# EAGLE design Parachute_V1 (EAGLE 9.6.2)
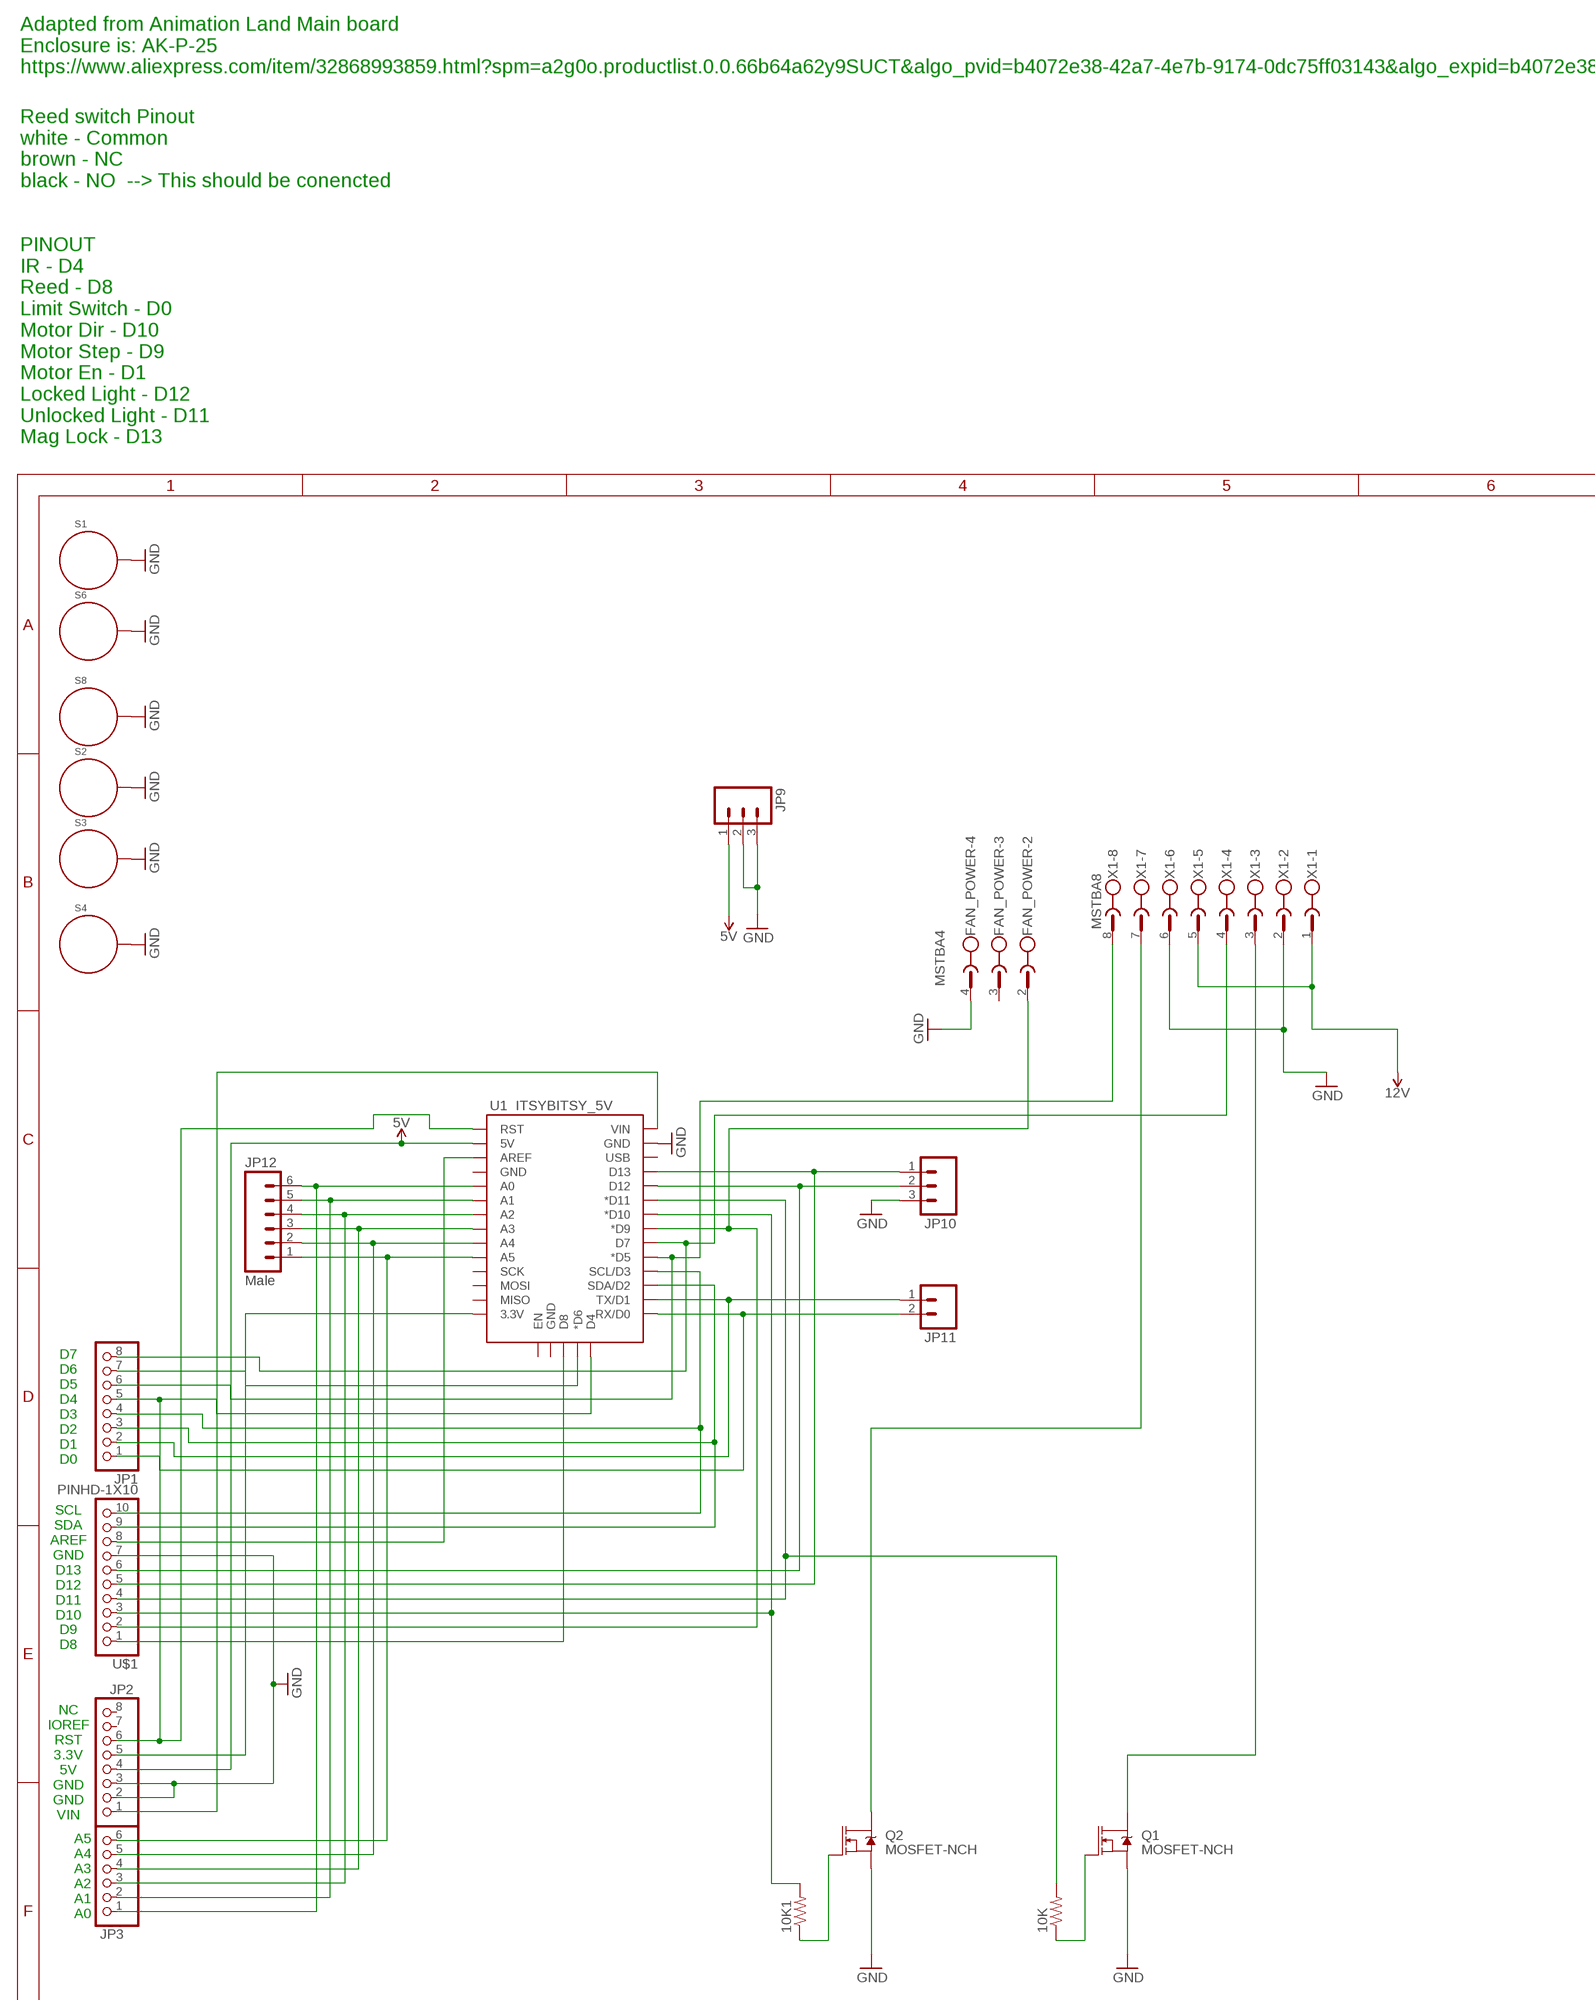
[diagram p0: schematic, sheet 1, part 1 of 2]
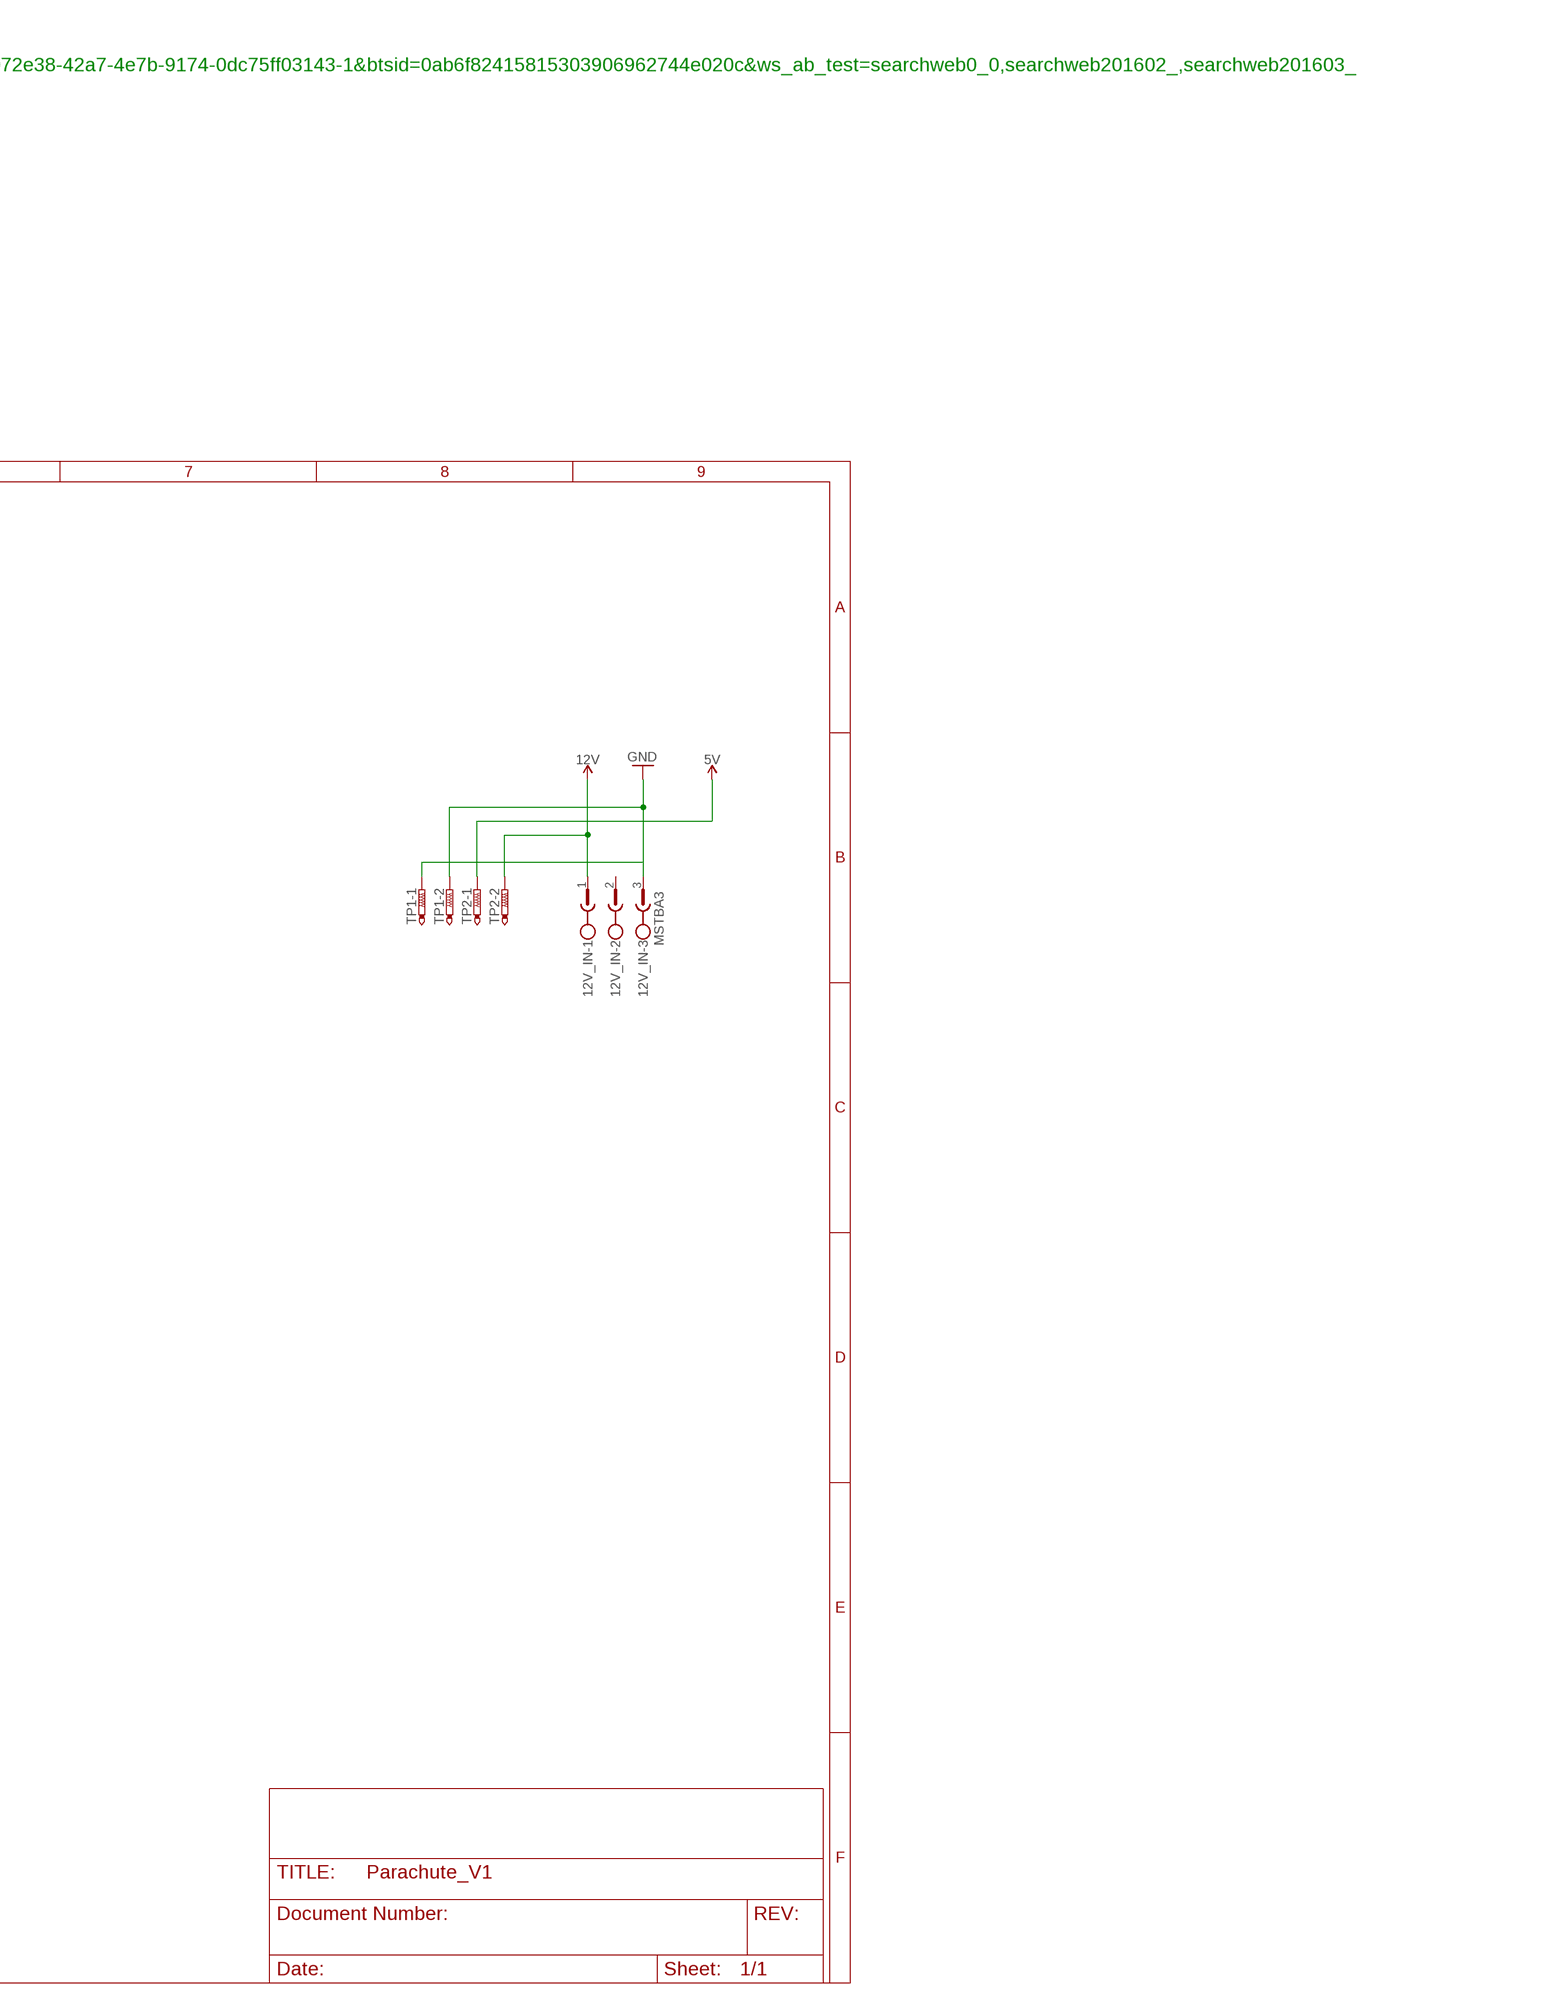
[diagram p1: schematic, sheet 1, part 2 of 2]

## Parts
10K  R-US_M0805  [M0805]
10K1  R-US_M0805  [M0805]
12V_IN  MSTBA3  [MSTBA3]
FAN_POWER  MSTBA4  [MSTBA4]
JP1  PINHD-1X8CLEANBIG  [1X08-CLEANBIG]
JP2  PINHD-1X8CLEANBIG  [1X08-CLEANBIG]
JP3  PINHD-1X6B  [1X06-BIG]
JP9  M031X03_NO_SILK  [1X03_NO_SILK]
JP10  M031X03_NO_SILK  [1X03_NO_SILK]
JP11  M021X02_NO_SILK  [1X02_NO_SILK]
JP12  Male  M06SIP  [1X06]
Q1  MOSFET-NCH  [SO-8_POWER_PAK]
Q2  MOSFET-NCH  [SO-8_POWER_PAK]
S1  STANDOFF_ELECTRICAL5-32  [STANDOFF_ELECTRICAL_5_32]
S2  STANDOFF_ELECTRICAL5-32  [STANDOFF_ELECTRICAL_5_32]
S3  STANDOFF_ELECTRICAL5-32  [STANDOFF_ELECTRICAL_5_32]
S4  STANDOFF_ELECTRICAL5-32  [STANDOFF_ELECTRICAL_5_32]
S6  STANDOFF_ELECTRICAL5-32  [STANDOFF_ELECTRICAL_5_32]
S8  STANDOFF_ELECTRICAL5-32  [STANDOFF_ELECTRICAL_5_32]
TP1  PTR2  [P2-38-17]
TP2  PTR2  [P2-38-17]
U1  ITSYBITSY_5V  [ADAFRUIT_LENOARDO]
U$1  PINHD-1X10  [1X10-BIG]
X1  MSTBA8  [MSTBA8]

## Nets
5V: JP2.4 JP9.1 TP2.TP-1 U1.5V
12V: 12V_IN.1 TP2.TP-2 X1.1 X1.5
GND: 12V_IN.3 FAN_POWER.4 JP2.2 JP2.3 JP9.2 JP9.3 JP10.3 Q1.S Q2.S S1.P1 S2.P1 S3.P1 S4.P1 S6.P1 S8.P1 TP1.TP-1 TP1.TP-2 U1.GND@2(GND) U$1.7 X1.2 X1.6
N$1: Q2.D1(D) X1.7
N$2: Q1.D1(D) X1.3
N$3: JP1.1 JP11.2 U1.RX(RX/D0)
N$4: U1.D8 U$1.1
N$5: JP1.2 JP11.1 U1.TX(TX/D1)
N$6: U1.AREF U$1.8
N$7: 10K.1 Q1.G
N$8: JP3.1 JP12.6 U1.A0
N$9: 10K1.1 Q2.G
N$10: JP3.2 JP12.5 U1.A1
N$11: JP3.3 JP12.4 U1.A2
N$12: JP3.4 JP12.3 U1.A3
N$13: JP3.5 JP12.2 U1.A4
N$14: JP3.6 JP12.1 U1.A5
N$15: JP10.2 U1.D12 U$1.6
N$16: JP1.3 U1.SDA(SDA/D2) U$1.9
N$17: JP1.4 U1.SCL(SCL/D3) U$1.10
N$18: JP10.1 U1.D13 U$1.5
N$19: JP1.6 U1.D5(*D5) X1.8
N$20: JP1.7 U1.D6(*D6)
N$21: JP1.8 U1.D7 X1.4
N$22: JP1.5 JP2.6 U1.D4 U1.RES(RST)
N$25: JP2.5 U1.3V(3.3V)
N$27: FAN_POWER.2 U1.D9(*D9) U$1.2
N$28: 10K1.2 U1.D10(*D10) U$1.3
N$29: 10K.2 U1.D11(*D11) U$1.4
N$31: JP2.1 U1.VIN
Unconnected: 12V_IN.2 FAN_POWER.1 FAN_POWER.3 JP2.7 JP2.8 U1.EN U1.GND@0(GND) U1.GND@1(GND) U1.MISO U1.MOSI U1.SCK U1.USB

## Notes on the sheet
- Adapted from Animation Land Main board
  Enclosure is: AK-P-25
  https://www.aliexpress.com/item/32868993859.html?spm=a2g0o.productlist.0.0.66b64a62y9SUCT&algo_pvid=b4072e38-42a7-4e7b-9174-0dc75ff03143&algo_expid=b4072e38-42a7-4e7b-9174-0dc75ff03143-1&btsid=0ab6f82415815303906962744e020c&ws_ab_test=searchweb0_0,searchweb201602_,searchweb201603_
- Reed switch Pinout
  white - Common
  brown - NC
  black - NO  --> This should be conencted
  
  
  PINOUT
  IR - D4
  Reed - D8
  Limit Switch - D0
  Motor Dir - D10
  Motor Step - D9
  Motor En - D1
  Locked Light - D12
  Unlocked Light - D11
  Mag Lock - D13
- D7
  D6
  D5
  D4
  D3
  D2
  D1
  D0
- SCL
  SDA
  AREF
  GND
  D13
  D12
  D11
  D10
  D9
  D8
- NC
  IOREF
  RST
  3.3V
  5V
  GND
  GND
  VIN
- A5
  A4
  A3
  A2
  A1
  A0

## Library data of the parts
10K 10K1 = adafruit:R-US_: RESISTOR, American symbol
12V_IN = con-phoenix-508:MSTBA3: PHOENIX; MF: FARNELL; MPN: 1757255; OC_FARNELL: 3705183; OC_NEWARK: 71C4162
FAN_POWER = th_libraries:MSTBA4: PHOENIX; MF: FARNELL; MPN: 1757268; OC_FARNELL: 3705195; OC_NEWARK: 71C4163
JP1 JP2 = adafruit:PINHD-1X8: PIN HEADER
JP3 = adafruit:PINHD-1X6: PIN HEADER
JP9 JP10 = SparkFun-Connectors:M03: Header 3 Standard 3-pin 0.1" header. Use with straight break away headers (SKU : PRT-00116), right angle break away headers (PRT-00553), swiss pins (PRT-00743), machine pins (PRT-00117), and female headers (PRT-00115). Molex polarized connector foot print use with SKU : PRT-08232 with associated crimp pins and housings.
JP11 = SparkFun-Connectors:M02: Standard 2-pin 0.1" header. Use with - straight break away headers ( PRT-00116) - right angle break away headers (PRT-00553) - swiss pins (PRT-00743) - machine pins (PRT-00117) - female headers (PRT-00115) Molex polarized connector foot print use with: PRT-08233 with associated crimp pins and housings. 2.54_SCREWTERM for use with PRT-10571. 3.5mm Screw Terminal footprints for PRT-08084 5mm Screw Terminal footprints for use with PRT-08433
JP12 = SparkFun-Connectors:M06: Header 6 Standard 6-pin 0.1" header. Use with straight break away headers (SKU : PRT-00116), right angle break away headers (PRT-00553), swiss pins (PRT-00743), machine pins (PRT-00117), and female headers (PRT-00115). Molex polarized connector foot print use with SKU : PRT-08094 with associated crimp pins and housings. NOTES ON THE VARIANTS LOCK and LOCK_LONGPADS... This footprint was designed to help hold the alignment of a through-hole component (i.e. 6-pin header) while soldering it into place. You may notice that each hole has been shifted either up or down by 0.005 of an inch from it's more standard position (which is a perfectly straight line). This slight alteration caused the pins (the squares in the middle) to touch the edges of the holes. Because they are alternating, it causes a "brace" to hold the component in place. 0.005 has proven to be the perfect amount of "off-center" position when using our standard breakaway headers. Although looks a little odd when you look at the bare footprint, once you have a header in there, the alteration is very hard to notice. Also,if you push a header all the way into place, it is covered up entirely on the bottom side. This idea of altering the position of holes to aid alignment will be further integrated into the Sparkfun Library for other footprints. It can help hold any component with 3 or more connection pins.
Q1 Q2 = th_ds_libraries:MOSFET-NCH: N-channel MOSFETs from Sparkfun-DiscreteSemi Library
S1-S4 S6 S8 = th_libraries:STANDOFF_ELECTRICAL: A standoff intended to be an electrically connected point. Pad size and stop size allow for a #8 Phillips pan screw head to make a solid connection to the board. Added 144mill drill hole that fits my normal wood screw
TP1 TP2 = testpad:PTR2: TEST PIN
U1 = th_ds_libraries:ITSYBITSY_5V: Adafruit ItsyBitsy 32u4 - 5V 16MHz https://www.adafruit.com/product/3677
U$1 = adafruit:PINHD-1X10: Pin header 1x10 0.1" spacing With round pins
X1 = con-phoenix-508:MSTBA8: PHOENIX; MF: FARNELL; MPN: 1757307; OC_FARNELL: 3705225; OC_NEWARK: 71C4166

## Board
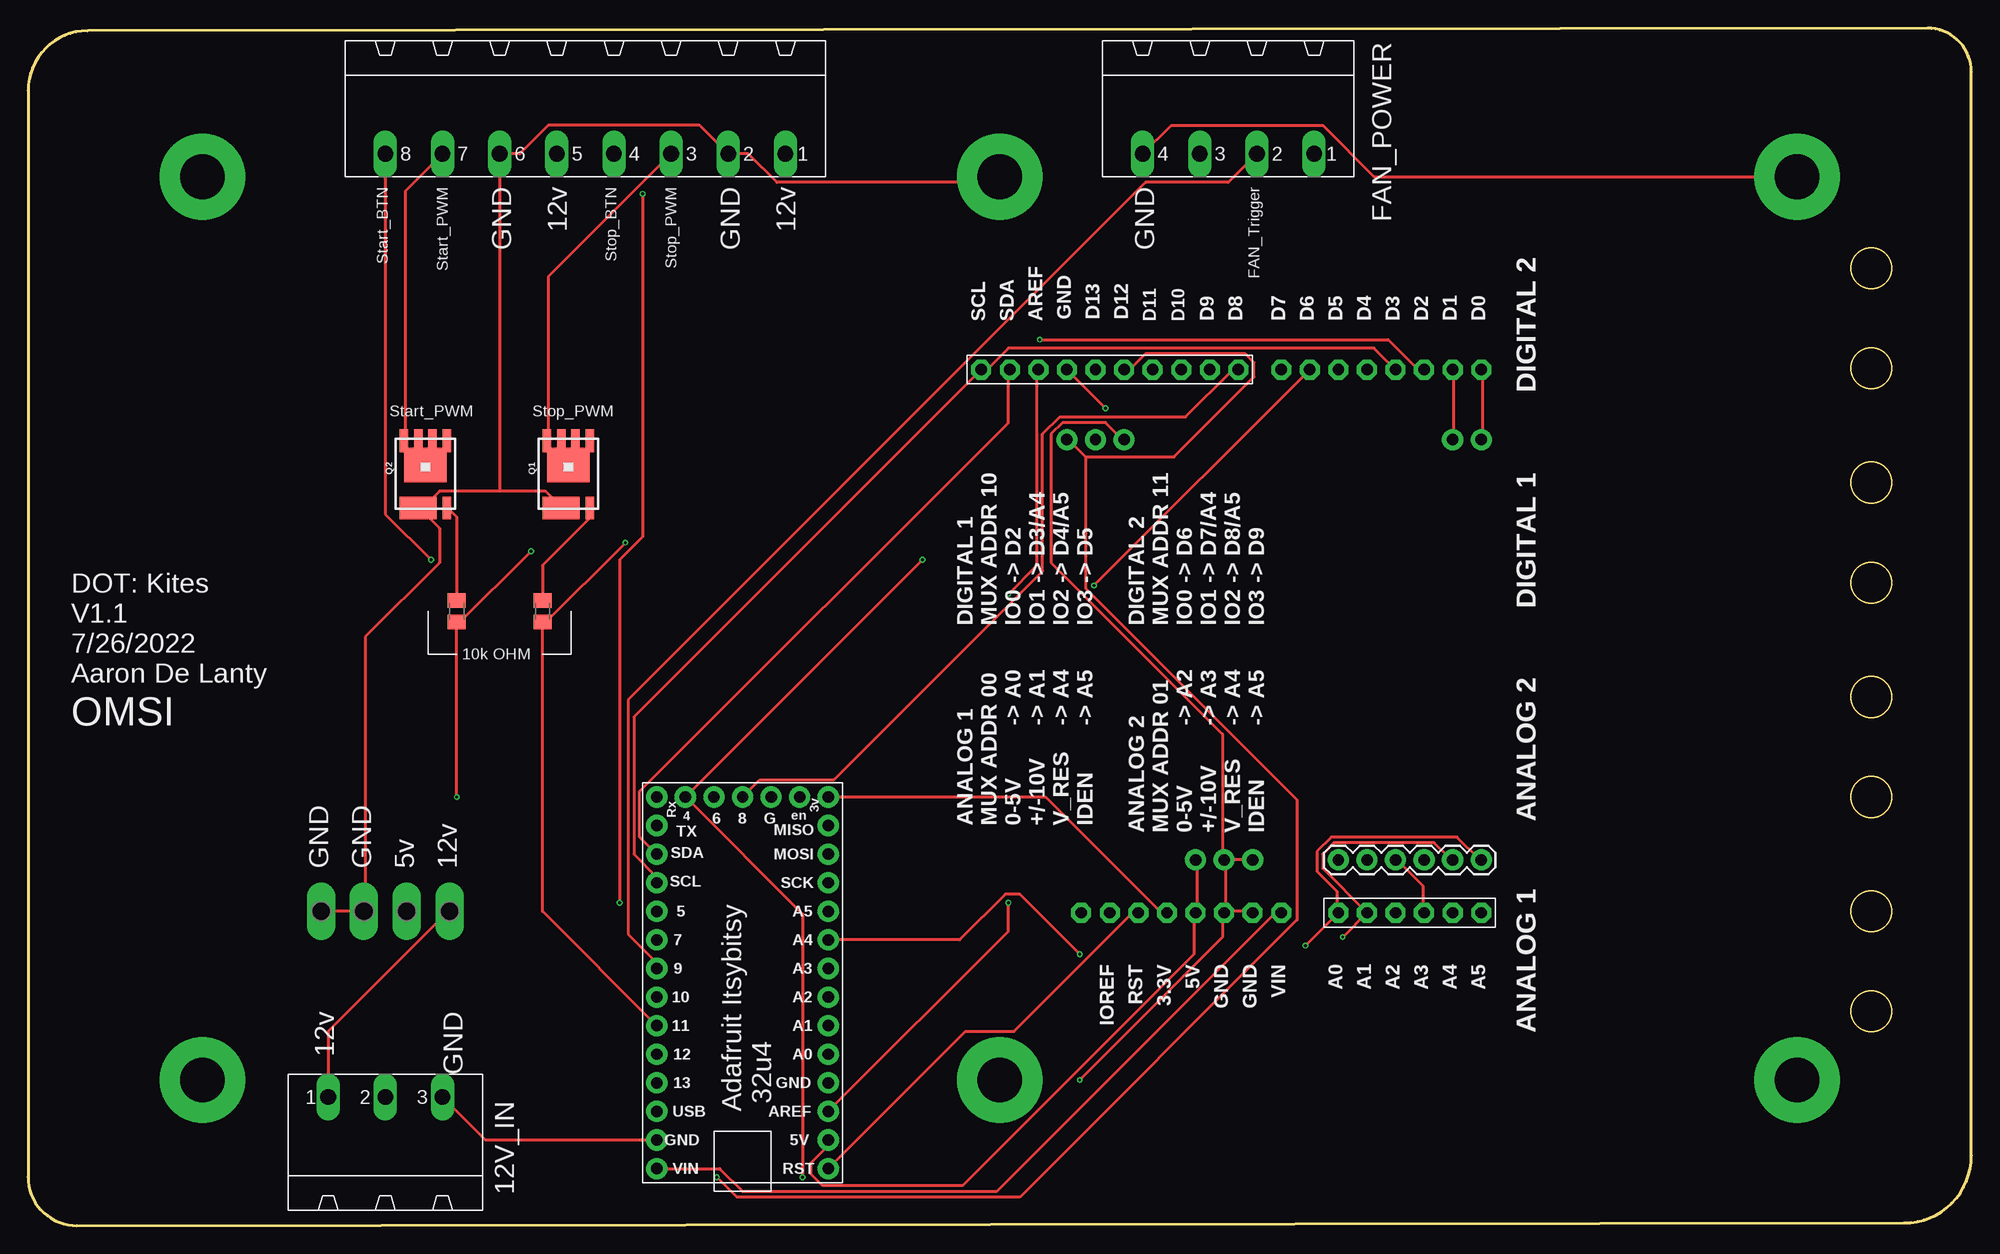
[diagram p2: board, top side]
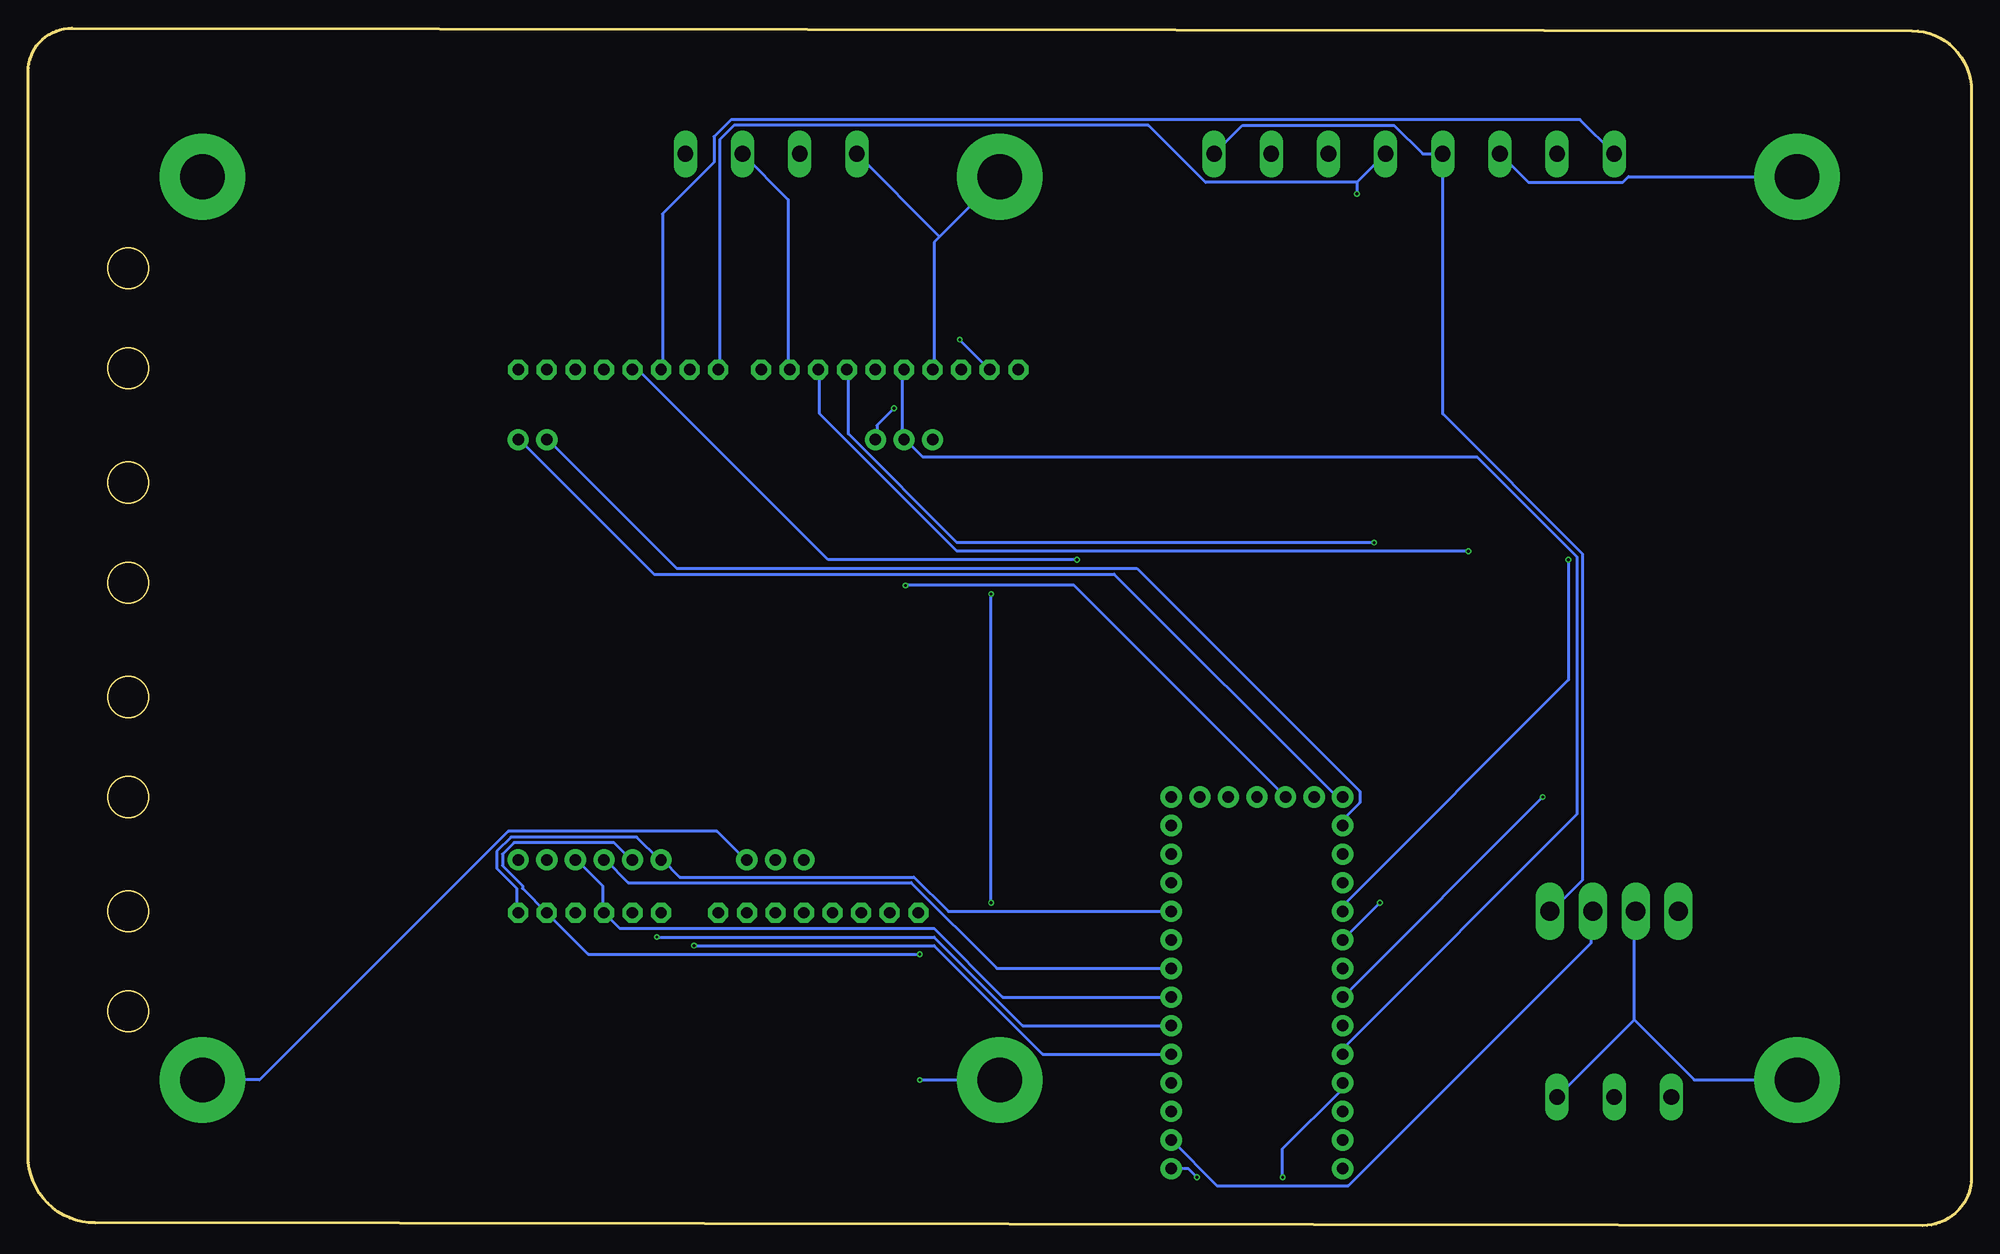
[diagram p3: board, bottom side, seen from below]

Size 172.72 x 106.41 mm. Coordinates in mm from the lower left corner, seen from the top.
Outline: 168.83,106.41 5.28,106.17 arc90 0,100.89 0,4.33 arc90 4.33,0 166.75,0.24 arc90 172.72,6.22 172.72,102.53 arc90 168.83,106.41
Outline: circle at 163.83,19.04 radius 1.8
Outline: circle at 163.83,27.93 radius 1.8
Outline: circle at 163.83,38.09 radius 1.8
Outline: circle at 163.83,46.98 radius 1.8
Outline: circle at 163.83,57.14 radius 1.8
Outline: circle at 163.83,66.03 radius 1.8
Outline: circle at 163.83,76.19 radius 1.8
Outline: circle at 163.83,85.08 radius 1.8
Copper layers (1*16): Top 0.035559375mm / dielectric 1.6mm / Bottom 0.035559375mm
Design rules "oshpark-2layer (1) *": minimum track width 10mil, minimum drill 10mil, track to track 10mil, track to pad 10mil, pad to pad 8mil, via to via 10mil, smd to smd 8mil, copper to edge 15mil, drill to drill 6mil, minimum pad ring 5mil, minimum via ring 5mil, stop-mask expansion 2.5mil, vias tented up to drill 25mil, thermal gap 10mil

### Footprints (pad centres in the part's own frame; a part is rotated, then mirrored left to right if it is on the bottom)
M0805 = smd 1.3 x 1.6: 1 -0.95,0; 2 0.95,0
MSTBA3 = drill 1.397 long: 1 -5.08,5.08; 2 0,5.08; 3 5.08,5.08
MSTBA4 = drill 1.397 long: 1 -7.62,5.08; 2 -2.54,5.08; 3 2.54,5.08; 4 7.62,5.08
1X08-CLEANBIG = drill 1.016 pad 1.778 octagon: 1 -8.89,0; 2 -6.35,0; 3 -3.81,0; 4 -1.27,0; 5 1.27,0; 6 3.81,0; 7 6.35,0; 8 8.89,0
1X06-BIG = drill 1.016 pad 1.778 octagon: 1 -6.35,0; 2 -3.81,0; 3 -1.27,0; 4 1.27,0; 5 3.81,0; 6 6.35,0
1X03_NO_SILK = drill 1.016 pad 1.88: 1 0,0; 2 2.54,0; 3 5.08,0
1X02_NO_SILK = drill 1.016 pad 1.88: 1 0,0; 2 2.54,0
1X06 = drill 1.016 pad 1.88: 1 0,0; 2 2.54,0; 3 5.08,0; 4 7.62,0; 5 10.16,0; 6 12.7,0
SO-8_POWER_PAK = smd 0.762 x 2.032: D1 -3.423,2.437; D2 -2.153,2.437; D3 -0.883,2.437; D4 0.387,2.437; G 0.387,-3.532 | smd 3.81 x 3.048: D5 -1.518,0.278 | smd 3.302 x 2.032: S -2.153,-3.532
STANDOFF_ELECTRICAL_5_32 = drill 3.969 pad 7.62: P1 0,0
P2-38-17 = drill 1.702 pad 2.121 long: TP-1 -1.905,0; TP-2 1.905,0
ADAFRUIT_LENOARDO = drill 1.016 pad 1.88: 3V -10.16,-21.59; 5V -10.16,8.89; A0 -10.16,1.27; A1 -10.16,-1.27; A2 -10.16,-3.81; A3 -10.16,-6.35; A4 -10.16,-8.89; A5 -10.16,-11.43; AREF -10.16,6.35; D4 2.54,-21.59; D5 5.08,-11.43; D6 0,-21.59; D7 5.08,-8.89; D8 -2.54,-21.59; D9 5.08,-6.35; D10 5.08,-3.81; D11 5.08,-1.27; D12 5.08,1.27; D13 5.08,3.81; EN -7.62,-21.59; GND@0 -10.16,3.81; GND@1 -5.08,-21.59; GND@2 5.08,8.89; MISO -10.16,-19.05; MOSI -10.16,-16.51; RES -10.16,11.43; RX 5.08,-21.59; SCK -10.16,-13.97; SCL 5.08,-13.97; SDA 5.08,-16.51; TX 5.08,-19.05; USB 5.08,6.35; VIN 5.08,11.43
1X10-BIG = drill 1.016 pad 1.778 octagon: 1 -11.43,0; 2 -8.89,0; 3 -6.35,0; 4 -3.81,0; 5 -1.27,0; 6 1.27,0; 7 3.81,0; 8 6.35,0; 9 8.89,0; 10 11.43,0
MSTBA8 = drill 1.397 long: 1 -17.78,5.08; 2 -12.7,5.08; 3 -7.62,5.08; 4 -2.54,5.08; 5 2.54,5.08; 6 7.62,5.08; 7 12.7,5.08; 8 17.78,5.08

### Placement (x,y rotation side)
10K  45.72,54.6 270 top
10K1  38.1,54.6 270 top
12V_IN  31.75,6.34 0 top
FAN_POWER  106.68,100.32 180 top
JP1  120.27,76.07 180 top
JP2  102.49,27.81 180 top
JP3  122.81,27.81 0 top
JP9  103.76,32.51 0 top
JP10  92.33,69.84 0 top
JP11  126.62,69.84 0 top
JP12  116.46,32.51 0 top
Q1  49.53,67.3 0 top
Q2  36.83,67.3 0 top
S1  15.49,93.21 0 top
S2  86.36,93.21 0 top
S3  157.23,12.95 0 top
S4  157.23,93.21 0 top
S6  86.36,12.95 0 top
S8  15.49,12.95 0 top
TP1  27.94,27.93 0 top
TP2  35.56,27.93 0 top
U1  60.96,16.5 180 top
U$1  96.14,76.07 180 top
X1  49.53,100.32 180 top

### Tracks (layer width: path | path; a pad name or v marks a point on that pad's centre or on a via)
5V
  Top 0.254: JP9.1 103.89,32.51 103.89,27.93 JP2.4 103.63,27.68 103.63,24.12 83.06,3.55 70.61,3.55 69.6,4.57 69.6,5.58 71.12,7.11 U1.5V
  Bottom 0.254: U1.5V 67.06,3.55 55.37,3.55 33.78,25.14 33.78,27.93 TP2.TP-1
12V
  Top 0.254: 12V_IN.1 26.67,17.27 37.34,27.93 TP2.TP-2
  Bottom 0.254: X1.1 64.77,97.78 51.31,97.78 48.77,95.24 X1.5 46.99,72.13 34.54,59.68 34.54,30.73 37.34,27.93 TP2.TP-2
GND  (via drill 0.25)
  Top 0.254: TP1.TP-1 TP1.TP-2 29.97,27.93 29.97,52.32 36.58,58.92 36.58,61.97 34.8,63.75 Q2.S 34.8,64 35.31,64 36.58,65.27 41.91,65.27 | U1.GND@2 40.64,7.61 12V_IN.3 | 41.91,65.27 45.97,65.27 47.24,64 Q1.S | 41.91,65.27 X1.6 43.69,95.24 46.23,97.78 59.69,97.78 X1.2 64.01,95.24 66.55,92.7 85.85,92.7 S2.P1 | 106.43,27.93 108.71,27.93 JP2.2 | JP9.3 106.43,32.51 | 106.43,32.51 106.43,27.93 | 106.43,27.93 JP2.3 106.17,27.68 106.17,25.65 v93.47,12.95 | 106.43,32.51 JP9.2 106.17,32.51 106.17,43.68 90.93,58.92 90.93,70.35 91.95,71.37 95.76,71.37 97.28,69.84 JP10.3 | U$1.7 v95.76,72.64 | S4.P1 119.63,93.21 115.06,97.78 101.6,97.78 FAN_POWER.4
  Bottom 0.254: 29.97,18.28 29.97,27.93 TP1.TP-2 | 12V_IN.3 29.97,18.28 | S8.P1 24.64,12.95 29.97,18.28 | S1.P1 30.48,93.21 30.99,92.7 39.37,92.7 X1.6 | S2.P1 91.69,87.88 | 91.69,87.88 92.2,87.37 92.2,76.19 U$1.7 | v95.76,72.64 97.28,71.11 97.28,69.84 JP10.3 | 91.69,87.88 FAN_POWER.4 | v93.47,12.95 S6.P1 | S3.P1 152.15,12.95 130.05,35.05 111.51,35.05 108.97,32.51 JP9.3
N$1
  Top 0.254: X1.7 33.53,91.94 33.53,69.84 Q2.D1
N$2
  Top 0.254: X1.3 46.23,84.32 46.23,69.84 Q1.D1
N$3
  Top 0.254: JP1.1 129.29,75.94 129.29,69.84 JP11.2
  Bottom 0.254: U1.RX 56.39,38.09 76.2,57.91 117.09,57.91 129.03,69.84 JP11.2
N$4
  Top 0.254: U1.D8 65.02,39.62 71.63,39.62 90.17,58.16 90.17,70.35 91.69,71.88 102.87,71.88 106.93,75.94 107.44,75.94 U$1.1
N$5
  Top 0.254: JP1.2 126.75,75.94 126.75,69.84 JP11.1
  Bottom 0.254: U1.TX 55.88,36.06 54.36,37.59 54.36,38.6 74.17,58.41 115.06,58.41 126.49,69.84 JP11.1
N$6  (via drill 0.25)
  Top 0.254: v87.12,56.13 89.66,58.67 89.66,75.94 U$1.8 | v87.12,28.7 87.12,26.16 U1.AREF
  Bottom 0.254: v87.12,28.7 v87.12,56.13
N$7
  Top 0.254: 10K.1 45.72,58.67 49.78,62.73 49.78,63.75 Q1.G
N$8  (via drill 0.25)
  Top 0.254: JP12.6 129.03,32.51 127,34.54 115.82,34.54 114.55,33.27 114.55,31.49 116.33,29.71 116.33,27.93 JP3.1 v113.54,24.89
  Bottom 0.254: U1.A0 82.55,15.23 92.2,24.89 v113.54,24.89
N$9
  Top 0.254: 10K1.1 38.1,62.99 37.34,63.75 Q2.G
N$10  (via drill 0.25)
  Top 0.254: JP12.5 126.49,32.51 124.97,34.03 116.08,34.03 115.06,33.01 115.06,31.74 JP3.2 v116.84,25.65
  Bottom 0.254: U1.A1 84.33,17.77 92.2,25.65 v116.84,25.65
N$11
  Bottom 0.254: JP12.4 123.95,32.51 121.67,30.22 121.67,27.93 JP3.3 120.14,26.41 92.2,26.41 86.11,20.31 U1.A2
N$12
  Top 0.254: JP3.4 123.95,27.93 123.95,30.22 121.67,32.51 JP12.3
  Bottom 0.254: U1.A3 86.61,22.85 94.23,30.47 119.38,30.47 121.41,32.51 JP12.3
N$13  (via drill 0.25)
  Top 0.254: U1.A4 82.8,25.39 86.87,29.46 88.14,29.46 v93.47,24.12
  Bottom 0.254: JP12.2 119.13,32.51 120.65,34.03 129.54,34.03 130.56,33.01 130.56,32 128.78,30.22 128.78,29.97 JP3.5 122.94,24.12 v93.47,24.12
N$14
  Bottom 0.254: JP3.6 129.29,27.93 129.29,29.97 131.06,31.74 131.06,33.27 129.79,34.54 118.62,34.54 116.59,32.51 JP12.1 116.33,32.51 114.81,30.98 93.98,30.98 90.93,27.93 U1.A5
N$15
  Bottom 0.254: U$1.6 95,75.94 95,69.84 JP10.2 94.74,69.84 93.22,68.32 43.94,68.32 35.05,59.43 35.05,36.57 55.88,15.74 U1.D12
N$16  (via drill 0.25)
  Top 0.254: U1.SDA 54.36,34.54 54.36,38.6 87.12,71.37 87.12,75.94 U$1.9 | v89.92,78.73 120.9,78.73 123.44,76.19 123.95,76.19 JP1.3
  Bottom 0.254: U$1.9 v89.92,78.73
N$17
  Top 0.254: JP1.4 119.63,77.97 87.12,77.97 85.34,76.19 84.84,76.19 U$1.10 53.85,45.21 53.85,33.01 55.88,30.98 U1.SCL
N$18  (via drill 0.25)
  Top 0.254: 93.98,68.32 101.85,68.32 108.97,75.43 108.97,76.7 108.2,77.46 99.31,77.46 98.04,76.19 97.54,76.19 U$1.5 | 93.98,68.32 92.46,69.84 JP10.1 | v61.21,4.31 62.99,2.53 88.14,2.53 112.78,27.17 112.78,37.84 93.98,56.64 93.98,68.32
  Bottom 0.254: U1.D13 55.88,12.19 61.21,6.85 v61.21,4.31
N$19  (via drill 0.25)
  Top 0.254: v35.81,59.18 31.75,63.24 X1.8
  Bottom 0.254: X1.8 34.8,98.29 110.24,98.29 111.76,96.77 111.76,94.48 116.33,89.91 116.33,76.19 JP1.6 | U1.D5 55.88,28.44 35.81,48.51 v35.81,59.18
N$20  (via drill 0.25)
  Top 0.254: v94.74,56.89 JP1.7
  Bottom 0.254: v94.74,56.89 79.76,56.89 U1.D6
N$21  (via drill 0.25)
  Top 0.254: v52.58,28.7 52.58,59.18 54.61,61.21 v54.61,91.69
  Bottom 0.254: 54.61,92.7 68.07,92.7 73.15,97.78 109.98,97.78 111.25,96.51 111.25,76.19 JP1.8 | X1.4 54.61,92.7 | v52.58,28.7 U1.D7 | 54.61,92.7 v54.61,91.69
N$22  (via drill 0.25)
  Top 0.254: v79.5,59.18 U1.D4 68.83,27.68 v68.83,4.31 | U1.RES 83.31,17.27 87.63,17.27 98.04,27.68 98.55,27.68 JP2.6
  Bottom 0.254: v79.5,59.18 101.6,59.18 118.36,75.94 118.87,75.94 JP1.5 | U1.RES 69.6,5.07 v68.83,4.31
N$25
  Top 0.254: U1.3V 90.42,38.09 100.58,27.93 101.09,27.93 JP2.5
N$27
  Top 0.254: U1.D9 55.88,23.36 53.34,25.9 53.34,46.73 99.31,92.7 106.68,92.7 FAN_POWER.2
  Bottom 0.254: FAN_POWER.2 105.16,91.18 105.16,76.19 U$1.2
N$28  (via drill 0.25)
  Top 0.254: v38.1,38.09 38.1,53.33 | 38.1,53.33 10K1.2 38.1,53.59 | 38.1,53.33 v44.7,59.94
  Bottom 0.254: U1.D10 v38.1,38.09 | v44.7,59.94 90.17,59.94 102.36,72.13 102.36,75.94 U$1.3
N$29  (via drill 0.25)
  Top 0.254: 45.72,53.33 45.72,27.93 U1.D11 | 45.72,53.33 10K.2 45.72,53.59 | 45.72,53.33 v53.09,60.7
  Bottom 0.254: v53.09,60.7 90.17,60.7 99.82,70.35 99.82,75.94 U$1.4
N$31
  Top 0.254: U1.VIN 61.47,5.07 63.5,3.04 86.11,3.04 110.74,27.68 111.25,27.68 JP2.1

### Text on the board
tPlace: SCL | DIGITAL 2 | DIGITAL 1 | -> A0 / -> A1 / -> A4 / -> A5 | ANALOG 2 | IOREF | RST | 3.3V | 5V | GND | GND | VIN | A0 | A1 | A2 | A3 | A4 | A5 | ANALOG 1 | Adafruit Itsybitsy / 32u4
tNames: Start_BTN | Start_PWM | GND | 12v | Stop_BTN | Stop_PWM | GND | 12v | GND | FAN_Trigger | SDA | AREF | GND | D13 | D12 | D11 | D10 | D9 | D8 | D7 | D6 | D5 | D4 | D3 | D2 | D1 | D0 | Start_PWM | Stop_PWM | DIGITAL 1 / MUX ADDR 10 / IO0 -> D2 / IO1 -> D3/A4 / IO2 -> D4/A5 / IO3 -> D5 | DIGITAL 2 / MUX ADDR 11 / IO0 -> D6 / IO1 -> D7/A4 / IO2 -> D8/A5 / IO3 -> D9 | 10k OHM | DOT: Kites / V1.1 / 7/26/2022 / Aaron De Lanty | OMSI | -> A2 / -> A3 / -> A4 / -> A5 | ANALOG 1 / MUX ADDR 00 / 0-5V / +/-10V / V_RES / IDEN | ANALOG 2 / MUX ADDR 01 / 0-5V / +/-10V / V_RES / IDEN | GND | GND | 5v | 12v | 12v | GND